# EasyEDA schematic ATTiny85_Binary_Counter.json
TITLE: ATTiny85 Binary Counter; REV: 2.0; Date: 2021-08-14; Sheet: 1/1
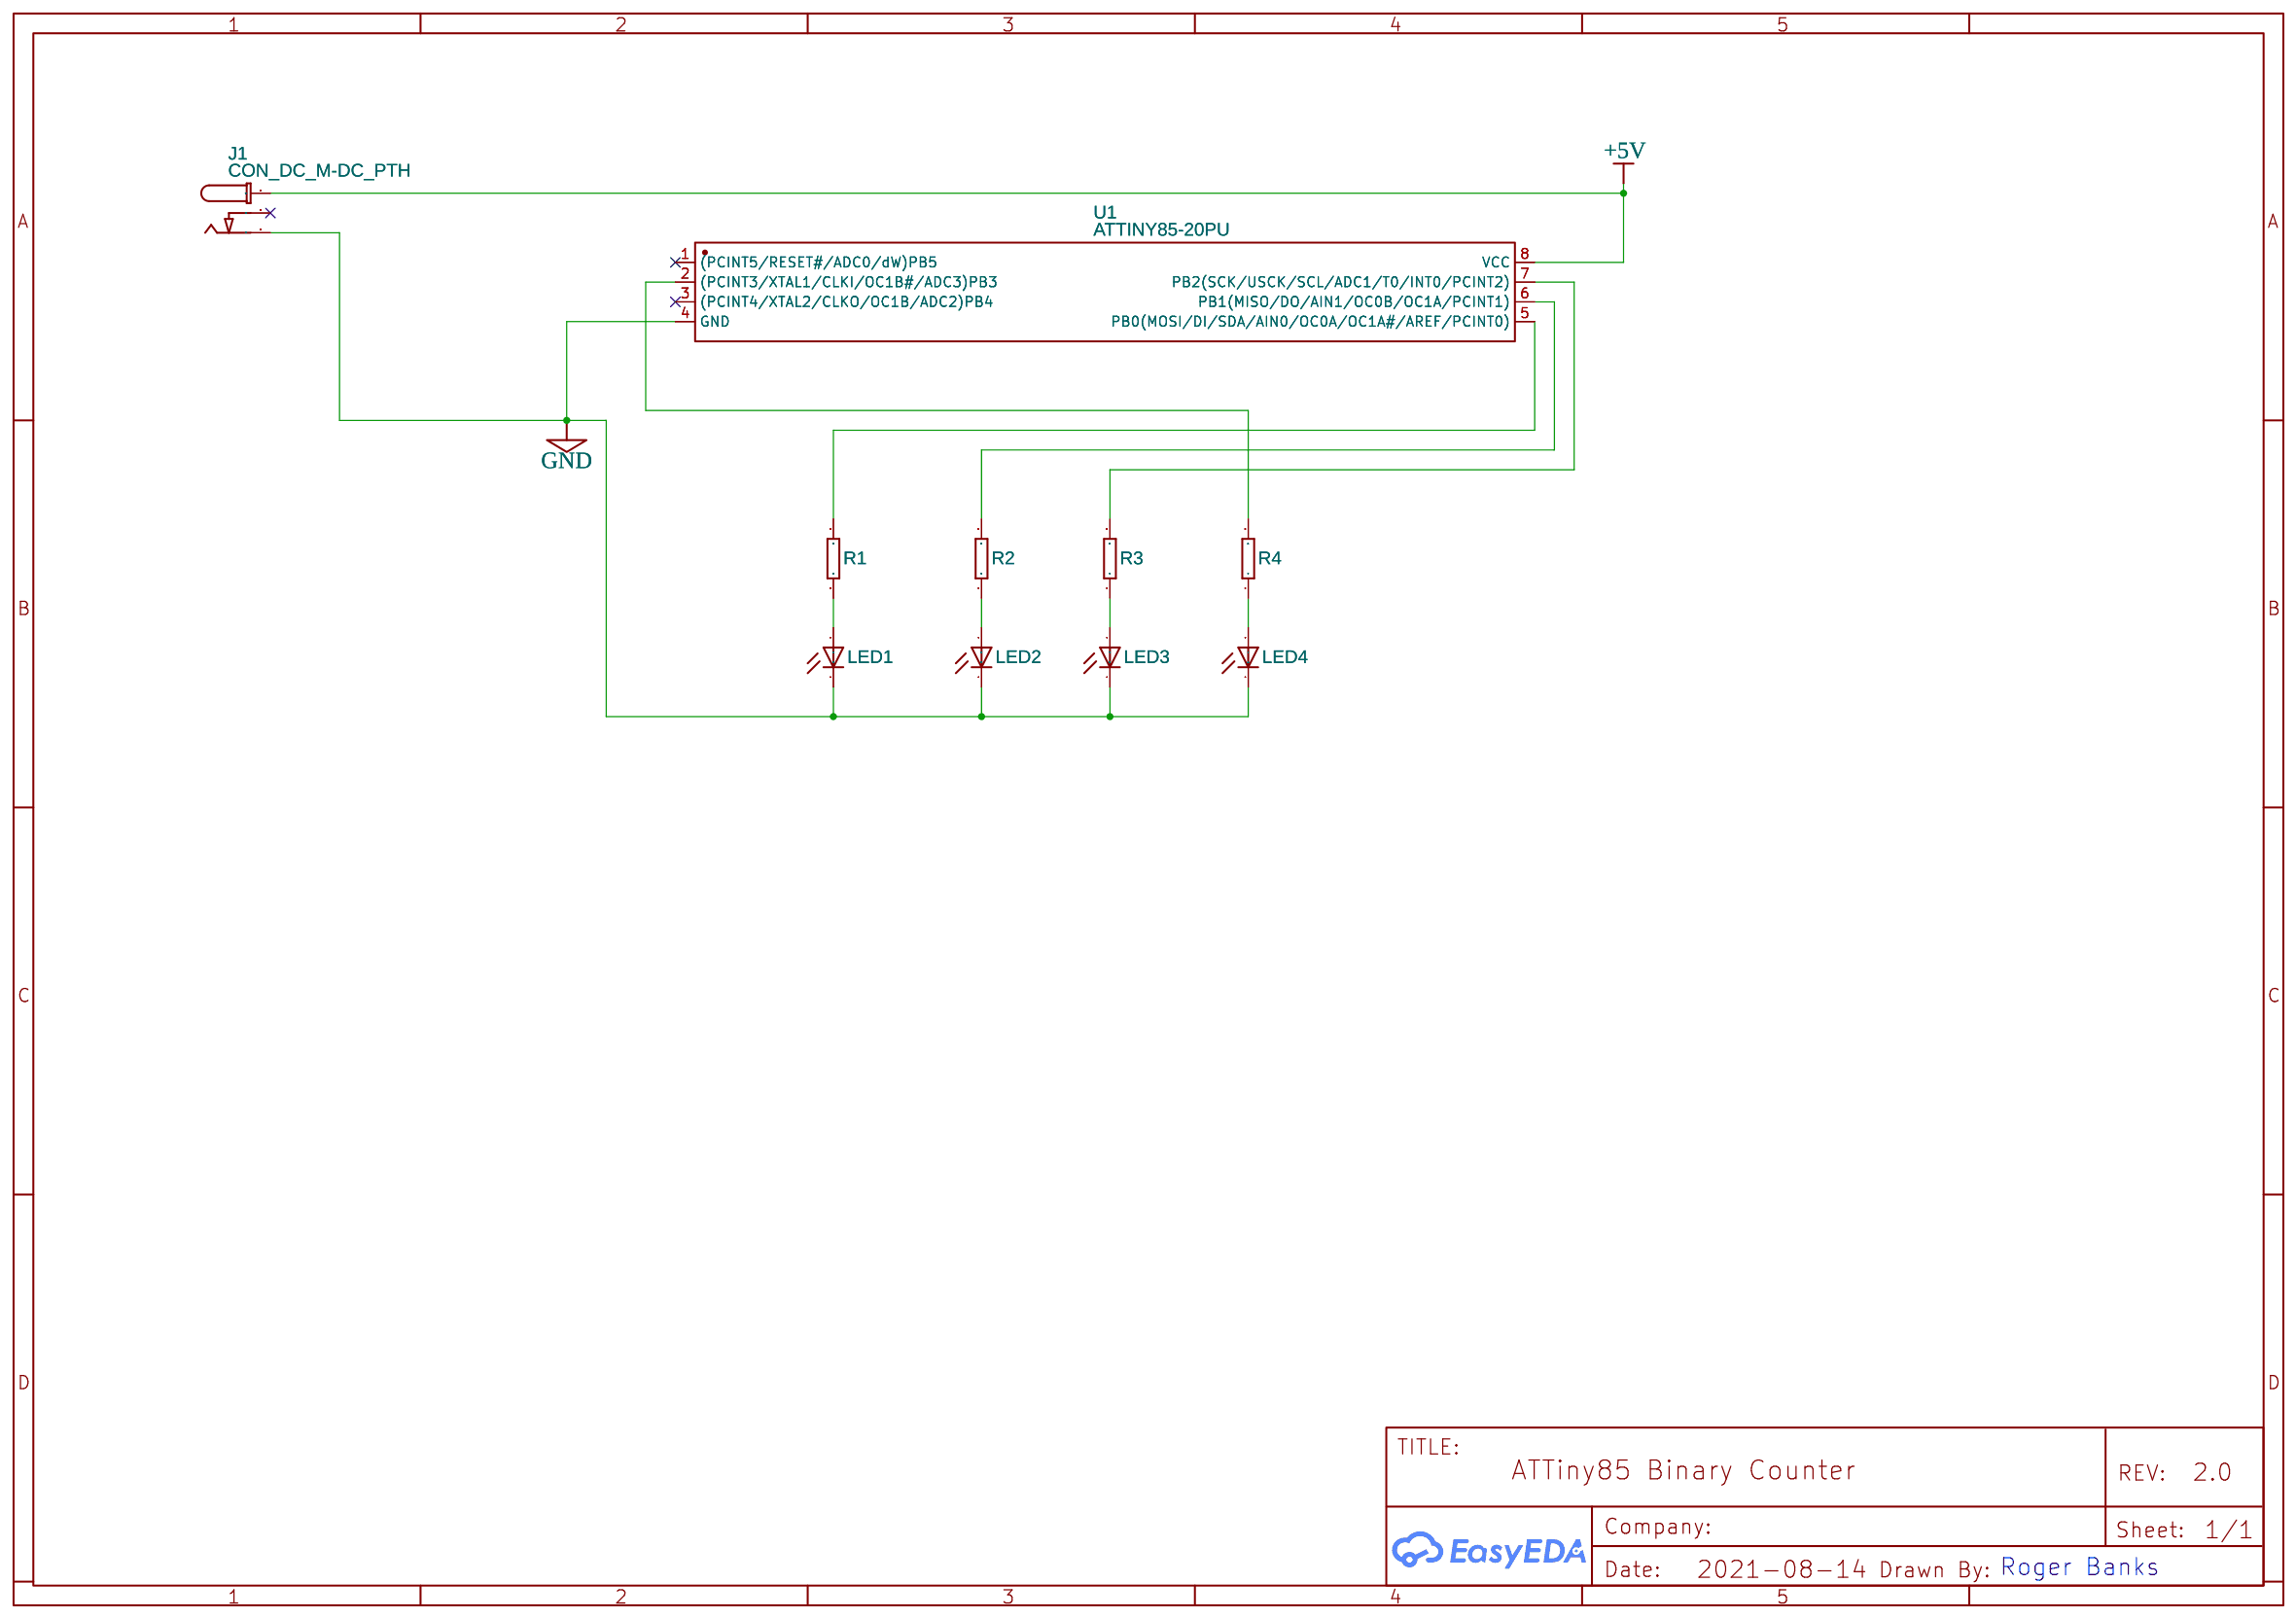
[diagram p0: schematic sheet]

## Parts
J1  CON_DC_M-DC_PTH  [DC_BARREL_JACK_PTH_2MM]
LED1  LED5MM  [LED5MM]
LED2  LED5MM  [LED5MM]
LED3  LED5MM  [LED5MM]
LED4  LED5MM  [LED5MM]
R1  RESISTOR  [RTH025W]
R2  RESISTOR  [RTH025W]
R3  RESISTOR  [RTH025W]
R4  RESISTOR  [RTH025W]
U1  ATTINY85-20PU  [PDIP-8_L9.3-W6.4-P2.54-LS7.6-BL]

## Library data of the parts
J1 = CON_DC_M-DC_PTH: DC power connector; Contributor: DangerousPrototype
LED1-LED4 = LED5MM: LEDs; Contributor: Pinoccio
R1-R4 = RESISTOR: Contributor: DangerousPrototype
U1 = ATTINY85-20PU: Supplier: LCSC; Supplier Part: C965497; Manufacturer: MICROCHIP(美国微芯); Contributor: LCSC

## Nets
+5V: J1.P1 U1.8(VCC)
GND: J1.P3(P2) LED1.K(C) LED2.K(C) LED3.K(C) LED4.K(C) U1.4(GND)
Net-(LED1-A): LED1.A R1.1
Net-(LED2-A): LED2.A R2.1
Net-(LED3-A): LED3.A R3.1
Net-(LED4-A): LED4.A R4.1
Net-(R1-2): R1.2 U1.5(PB0(MOSI/DI/SDA/AIN0/OC0A/OC1A#/AREF/PCINT0))
Net-(R2-2): R2.2 U1.6(PB1(MISO/DO/AIN1/OC0B/OC1A/PCINT1))
Net-(R3-2): R3.2 U1.7(PB2(SCK/USCK/SCL/ADC1/T0/INT0/PCINT2))
Net-(R4-2): R4.2 U1.2((PCINT3/XTAL1/CLKI/OC1B#/ADC3)PB3)

Not connected (* = marked no-connect by the designer): J1 P2(P3)*; U1 1((PCINT5/RESET#/ADC0/dW)PB5)* 3((PCINT4/XTAL2/CLKO/OC1B/ADC2)PB4)*

## Notes on the sheet
- Roger Banks
